# Altium schematic sheet LB-word-gpioExpanders.SchDoc
size A
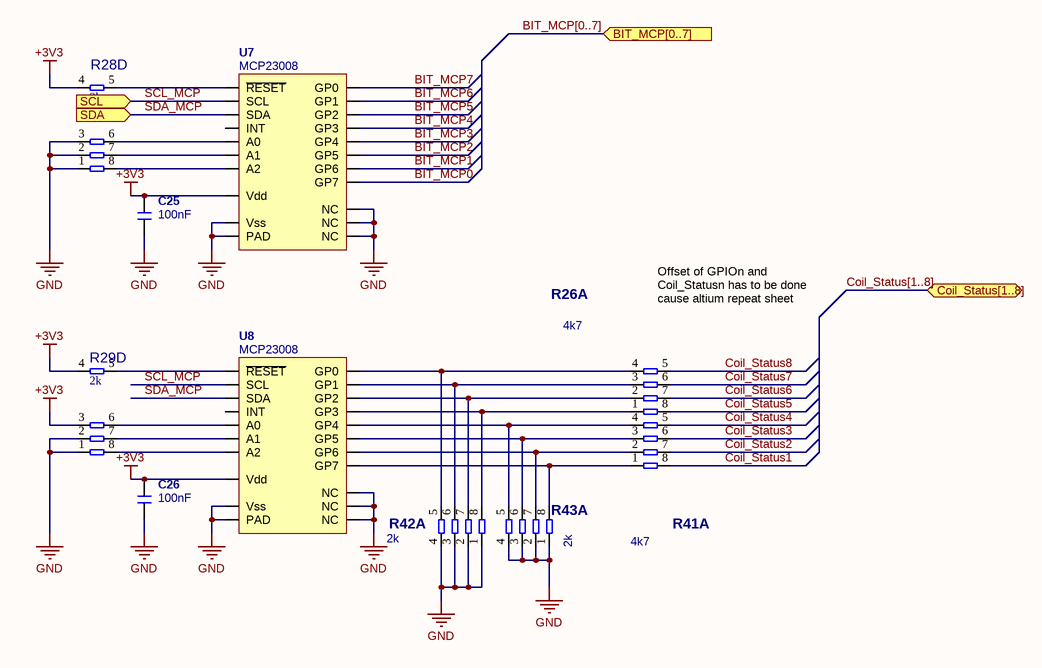
[diagram p0: LB-word-gpioExpanders.SchDoc]

## Parts
C25  100nF  [C0603_N]
C26  100nF  [C0603_N]
R26  value 4k7  [YC164]  (parts A,B,C,D of 4)
R28  (no value)  [YC164]  (parts A,B,C,D of 4)
R29  (no value)  [YC164]  (parts A,B,C,D of 4)
R41  value 4k7  [YC164]  (parts A,B,C,D of 4)
R42  value 2k  [YC164]  (parts A,B,C,D of 4)
R43  value 2k  [YC164]  (parts A,B,C,D of 4)
U7  MCP23008  [QFN20]
U8  MCP23008  [QFN20]

## Ports
BIT_MCP[0..7] (in), Coil_Status[1..8] (bidir), SCL (in), SDA (in)

## Nets
+3V3: C25.1 C26.1 R28.4 R29.3 R29.4 U7.18(Vdd) U8.18(Vdd)
GND: C25.2 C26.2 R28.1 R28.2 R28.3 R29.1 R29.2 R42.1 R42.2 R42.3 R42.4 R43.1 R43.2 R43.3 R43.4 U7.5(NC) U7.6(NC) U7.8(NC) U7.17(Vss) U7.PAD U8.5(NC) U8.6(NC) U8.8(NC) U8.17(Vss) U8.PAD
BIT_MCP0: U7.16(GP7)
BIT_MCP1: U7.15(GP6)
BIT_MCP2: U7.14(GP5)
BIT_MCP3: U7.13(GP4)
BIT_MCP4: U7.12(GP3)
BIT_MCP5: U7.11(GP2)
BIT_MCP6: U7.10(GP1)
BIT_MCP7: U7.9(GP0)
Coil_Status1: R41.8
Coil_Status2: R41.7
Coil_Status3: R41.6
Coil_Status4: R41.5
Coil_Status5: R26.8
Coil_Status6: R26.7
Coil_Status7: R26.6
Coil_Status8: R26.5
SCL_MCP: U7.19(SCL) U8.19(SCL) ; port SCL
SDA_MCP: U7.20(SDA) U8.20(SDA) ; port SDA
NetR26_1: R26.1 R42.8 U8.12(GP3)
NetR26_2: R26.2 R42.7 U8.11(GP2)
NetR26_3: R26.3 R42.6 U8.10(GP1)
NetR26_4: R26.4 R42.5 U8.9(GP0)
NetR28_5: R28.5 U7.4(~{RESET})
NetR28_6: R28.6 U7.3(A0)
NetR28_7: R28.7 U7.2(A1)
NetR28_8: R28.8 U7.1(A2)
NetR29_5: R29.5 U8.4(~{RESET})
NetR29_6: R29.6 U8.3(A0)
NetR29_7: R29.7 U8.2(A1)
NetR29_8: R29.8 U8.1(A2)
NetR41_1: R41.1 R43.8 U8.16(GP7)
NetR41_2: R41.2 R43.7 U8.15(GP6)
NetR41_3: R41.3 R43.6 U8.14(GP5)
NetR41_4: R41.4 R43.5 U8.13(GP4)

Not connected (* = marked no-connect by the designer): U7 7(INT); U8 7(INT)

## Buses and harness runs
bus BIT_MCP[0..7] = port BIT_MCP[0..7]
bus Coil_Status[1..8] = port Coil_Status[1..8]

## Notes on the sheet
- Offset of GPIOn and Coil_Statusn has to be done cause altium repeat sheet does not support start at zero.

## Library data of the parts
C25 C26 = Capacitor: Capacitor MLCC; Manufacturer: Yageo; Manufacturer Part Number: CC0603KRX7R9BB104; Tolerance (%): 10; Category: Capacitor; Package: 0603; Value: 100nF; Supplier Part Number 1: 1362556; Supplier 1: Farnell; ComponentLink1URL: http://www.yageo.com; ComponentLink1Description: Manufacturer Website; Voltage Rating (Volts): *; Supplier 2: Digi-Key; Supplier Part Number 2: 311-1344-1-ND
R26 R41-R43 = Resistor Array - 4P
R28 R29 = Resistor Array - 4P: Value: 2k
U7 U8 = MCP23008: I2C Port Expander